# EasyEDA Pro project Project_FALLOUT HK PAD.epro

# Schematic Schematic2
Board Name: PCB3; Create Date: 2026-05-14; Page Name: P1; Project Name: FALLOUT HK PAD; Schematic Name: Schematic2; Update Date: 2026-05-15; Company: EasyEDA.com; Page Size: A4; Version: V1.0
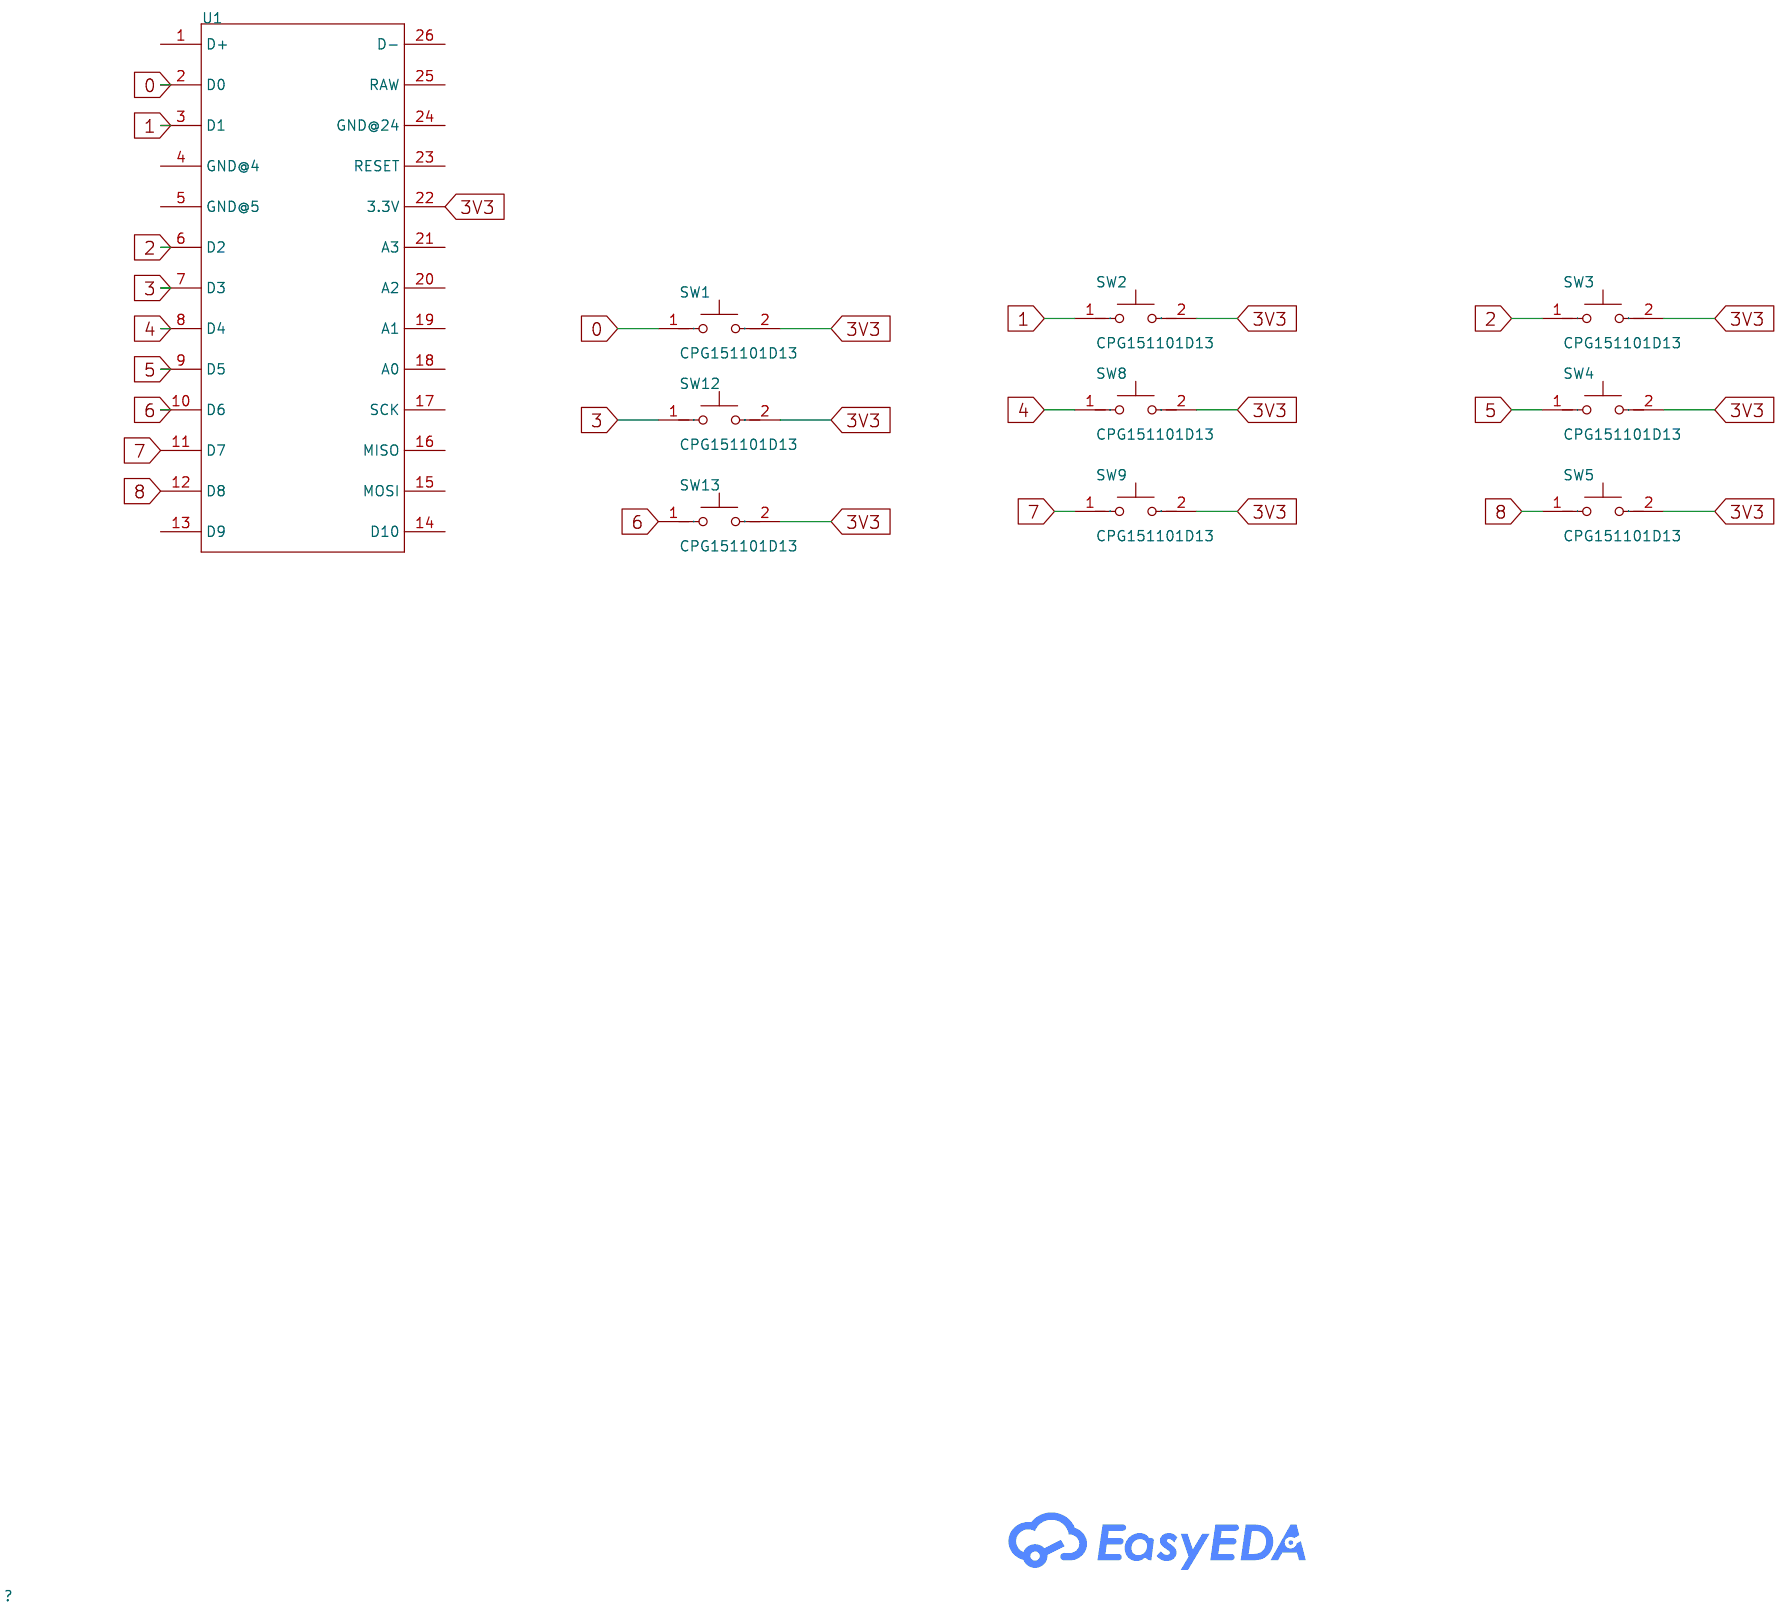
[diagram p0: schematic sheet]

## Parts
SW1  CPG151101D13  [KEY-TH_CPG1511F01S0X]
SW2  CPG151101D13  [KEY-TH_CPG1511F01S0X]
SW3  CPG151101D13  [KEY-TH_CPG1511F01S0X]
SW4  CPG151101D13  [KEY-TH_CPG1511F01S0X]
SW5  CPG151101D13  [KEY-TH_CPG1511F01S0X]
SW8  CPG151101D13  [KEY-TH_CPG1511F01S0X]
SW9  CPG151101D13  [KEY-TH_CPG1511F01S0X]
SW12  CPG151101D13  [KEY-TH_CPG1511F01S0X]
SW13  CPG151101D13  [KEY-TH_CPG1511F01S0X]
U1  -  [KB2040_SMD]

## Library data of the parts
SW1-SW5 SW8 SW9 SW12 SW13 = CPG151101D13: Axis Type:Blue Switch Operation Force:50gf Conduction Travel:2.2mm Voltage Rating:12V Operating Temperature:-40℃~+70℃ Operating Temperature:-40℃~+70℃; LCSC Part Name: 青轴; Supplier Part: C49234235; Manufacturer: HanElectricity(瀚源); Supplier Footprint: 插件; JLCPCB Part Class: Extended Part; Datasheet: https://item.szlcsc.com/datasheet/CPG151101D13/51650377.html; Supplier: LCSC; Axis Type: Blue Switch; Operation Force: 50gf; Conduction Travel: 2.2mm; Voltage Rating: 12V; Operating Temperature: -40℃~+70℃
U1 = KB2040

## Nets
3V3: SW1.2 SW2.2 SW3.2 SW4.2 SW5.2 SW8.2 SW9.2 SW12.2 SW13.2 U1.22(3.3V)
0: SW1.1 U1.2(D0)
1: SW2.1 U1.3(D1)
2: SW3.1 U1.6(D2)
3: SW12.1 U1.7(D3)
4: SW8.1 U1.8(D4)
5: SW4.1 U1.9(D5)
6: SW13.1 U1.10(D6)
7: SW9.1 U1.11(D7)
8: SW5.1 U1.12(D8)

Not connected (* = marked no-connect by the designer): U1 1(D+) 4(GND@4) 5(GND@5) 13(D9) 14(D10) 15(MOSI) 16(MISO) 17(SCK) 18(A0) 19(A1) 20(A2) 21(A3) 23(RESET) 24(GND@24) 25(RAW) 26(D-)

# Board PCB3
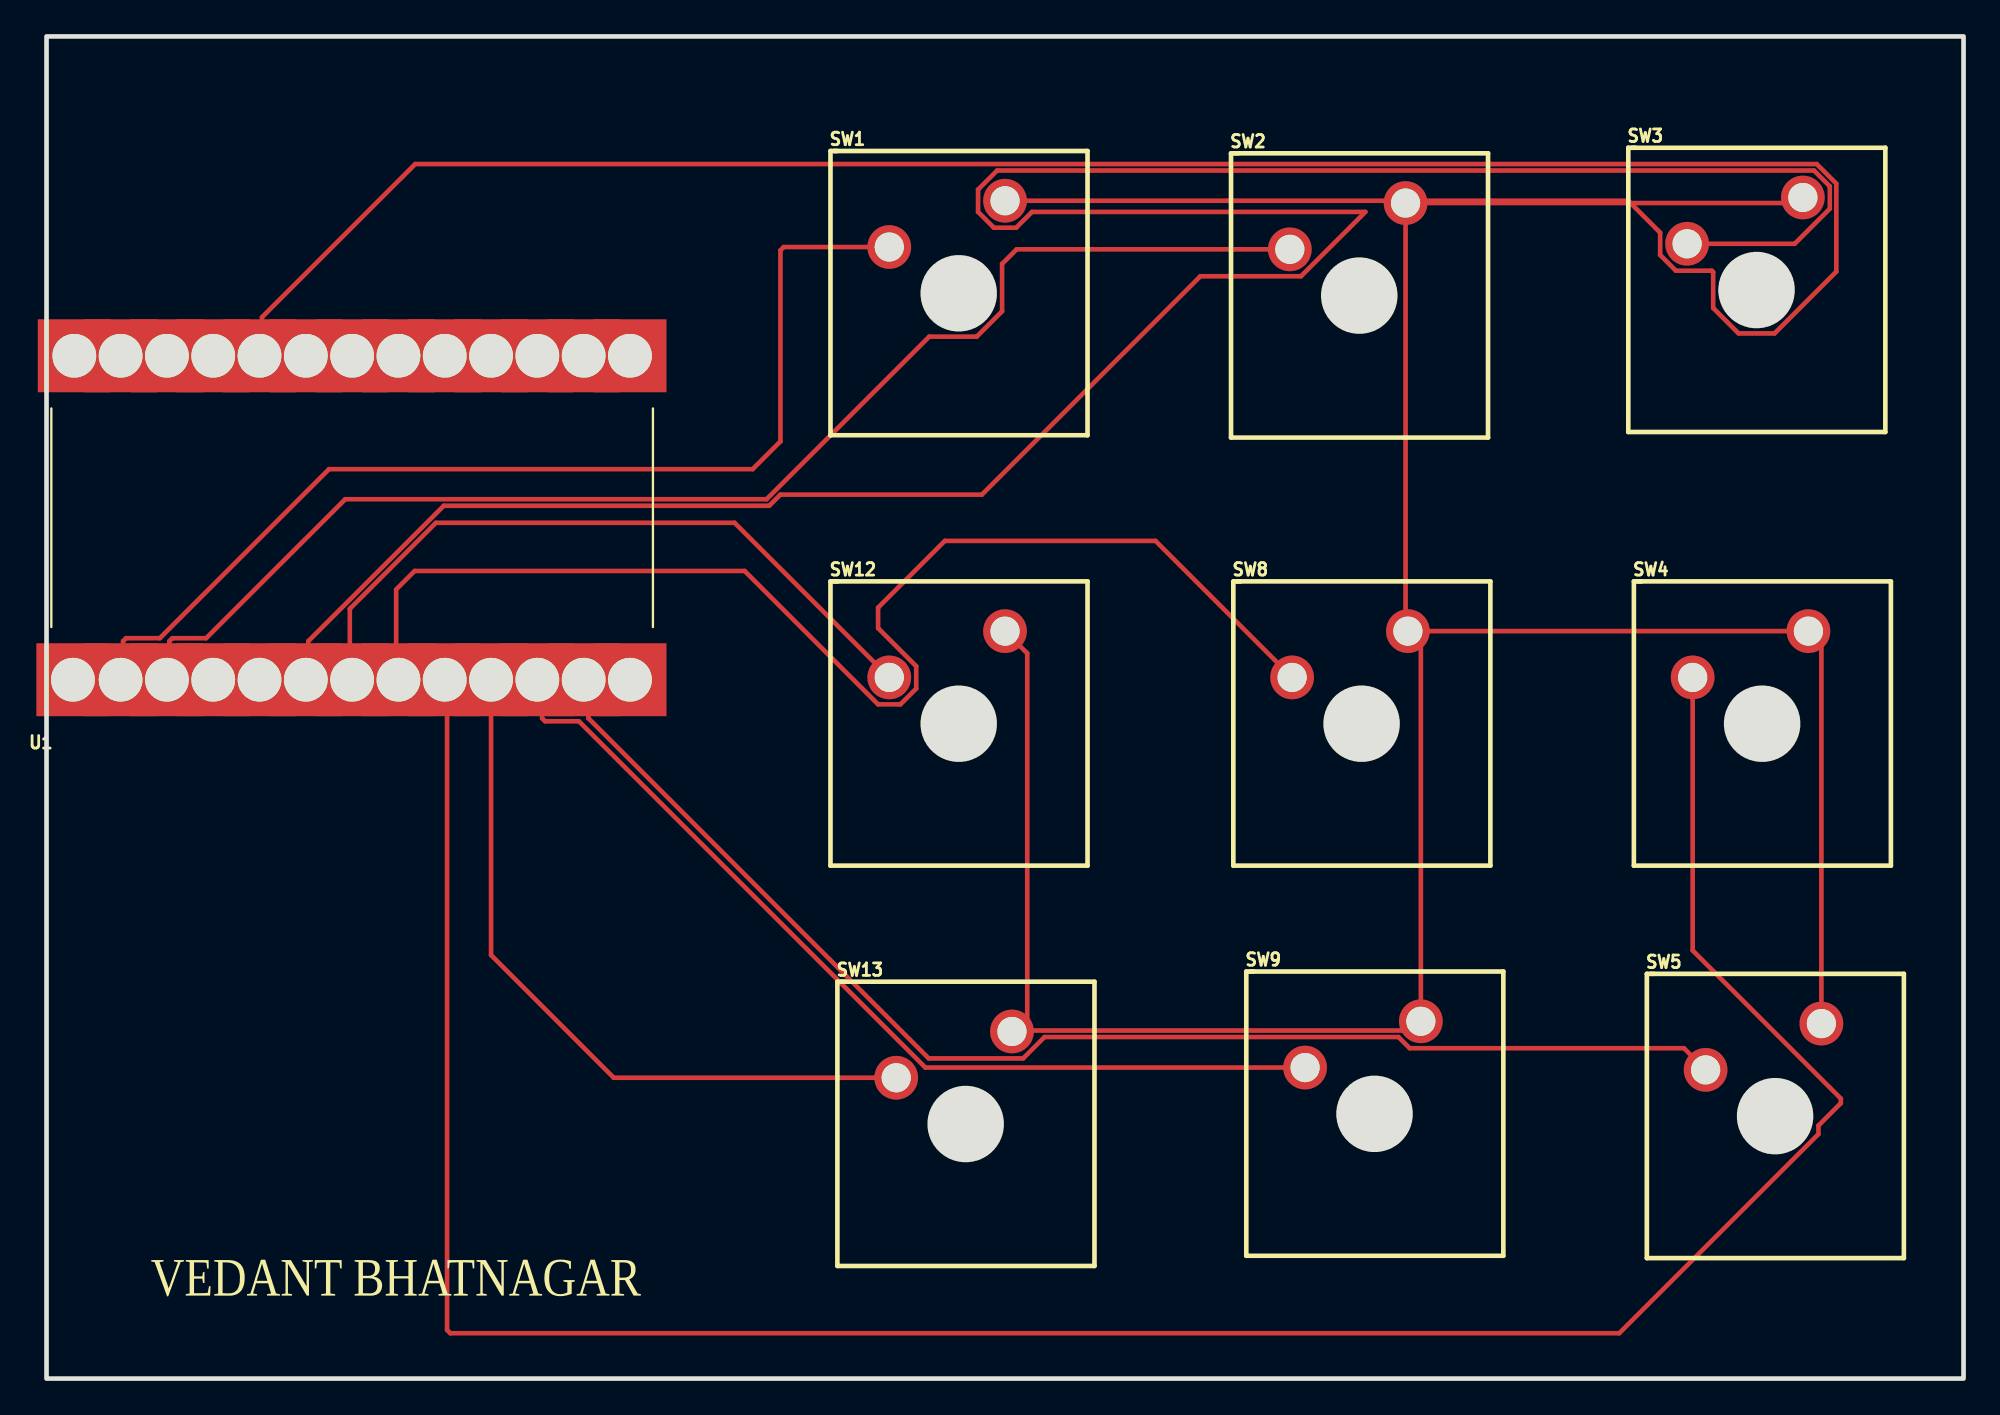
[diagram p1: board, top side]
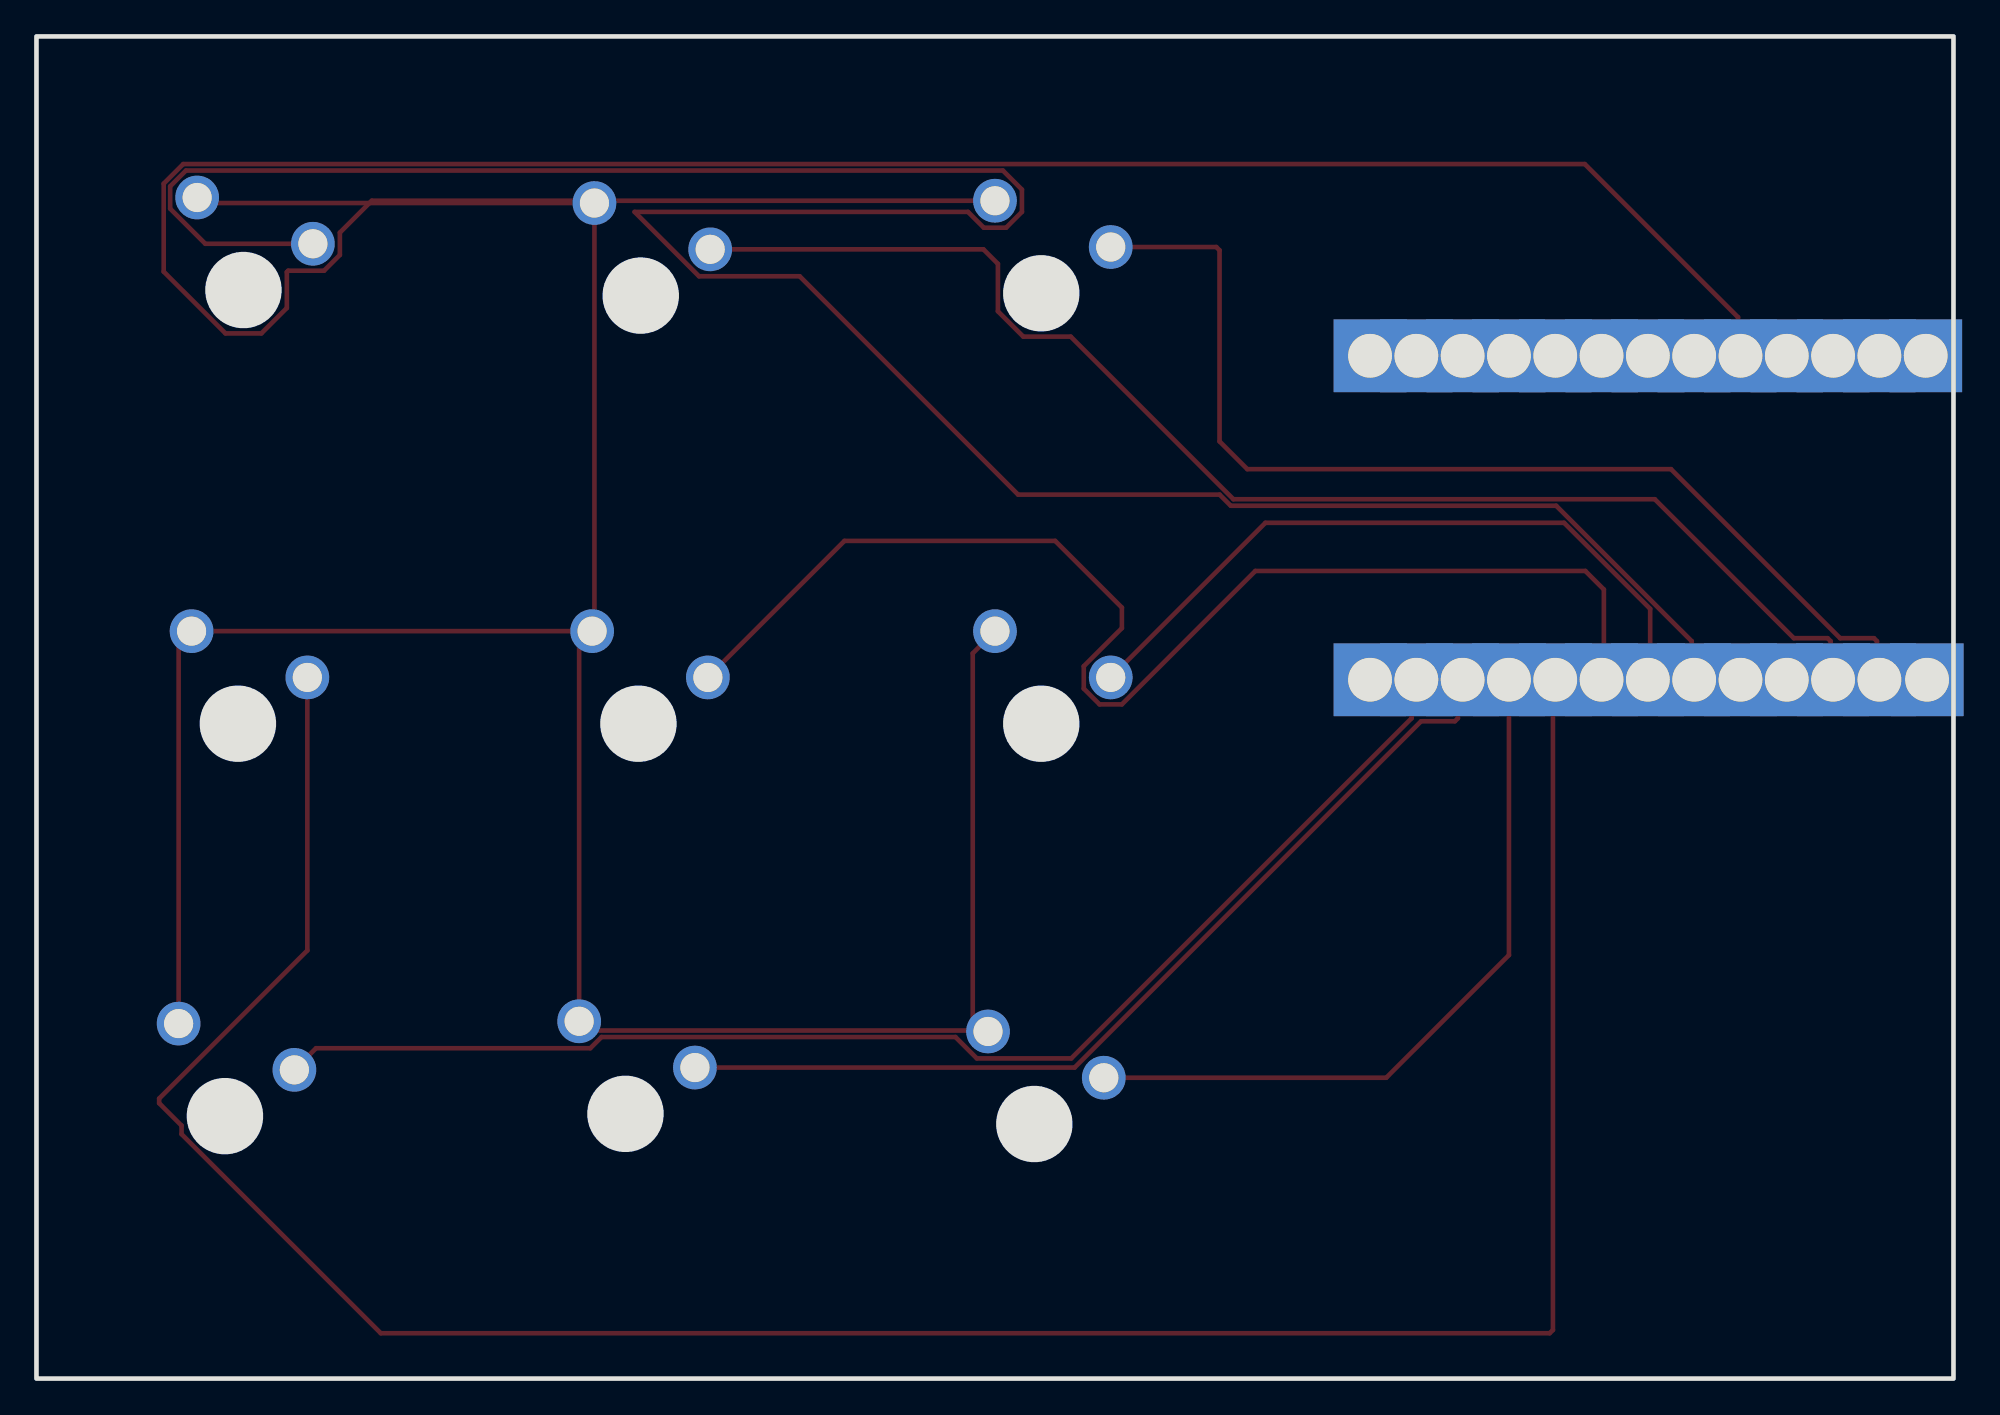
[diagram p2: board, bottom side, seen from below]

Outline 105.16 x 73.66 mm; copper layers: Top Layer, Bottom Layer. Coordinates in mm from the lower left corner of the outline.
Outline path: rectangle 0,73.66 105.16,0
Stack: Top Layer 0.035mm / Dielectric1 1.51mm FR4 er 4.5 / Bottom Layer 0.035mm

## Design rules (mm)
template: JLCPCB Capability(Two Layers Board)
spacing copperThickness1oz (default): track to track 0.102, other pairs 0.152 to 0.3
spacing copperThickness2oz: track to track 0.203, other pairs 0.152 to 0.3
track width copperThickness1oz (default): min 0.127, default 0.254, max 2.54
track width copperThickness2oz: min 0.203, default 0.254, max 2.54
differential pair differentialPair (default): width min 0.127, default 0.254, max 2.54; gap min 0.152, default 0.152
via viaSize (default): diameter min 0.5, default 0.61, max 10; hole min 0.3, default 0.305, max 6.3

## Placement (name value [footprint] x y rotation side)
SW1  CPG151101D13  [KEY-TH_CPG1511F01S0X]  49.4 63.37 0 top
SW2  CPG151101D13  [KEY-TH_CPG1511F01S0X]  71.37 63.25 0 top
SW3  CPG151101D13  [KEY-TH_CPG1511F01S0X]  93.17 63.55 0 top
SW4  CPG151101D13  [KEY-TH_CPG1511F01S0X]  93.47 39.75 0 top
SW5  CPG151101D13  [KEY-TH_CPG1511F01S0X]  94.18 18.21 0 top
SW8  CPG151101D13  [KEY-TH_CPG1511F01S0X]  71.5 39.75 0 top
SW9  CPG151101D13  [KEY-TH_CPG1511F01S0X]  72.21 18.34 0 top
SW12  CPG151101D13  [KEY-TH_CPG1511F01S0X]  49.4 39.75 0 top
SW13  CPG151101D13  [KEY-TH_CPG1511F01S0X]  49.78 17.78 0 top
U1  -  [KB2040_SMD]  16.76 47.24 0 top

## Footprints (pads in the part's own frame, mm; a bottom-side part is the same pattern mirrored in y, then rotated)
KB2040_SMD
  rect 4x4 hole 2.4: 1(-15.316,-8.89) 2(-12.7,-8.89) 3(-10.16,-8.89) 4(-7.62,-8.89) 5(-5.08,-8.89) 6(-2.54,-8.89) 7(0,-8.89) 8(2.54,-8.89) 9(5.08,-8.89) 10(7.62,-8.89) 11(10.16,-8.89) 12(12.7,-8.89) 13(15.24,-8.89) 14(15.24,8.89) 15(12.7,8.89) 16(10.16,8.89) 17(7.62,8.89) 18(5.08,8.89) 19(2.54,8.89) 20(0,8.89) 21(-2.54,8.89) 22(-5.08,8.89) 23(-7.62,8.89) 24(-10.16,8.89) 25(-12.7,8.89) 26(-15.24,8.89)
KEY-TH_CPG1511F01S0X
  round 2.4 hole 1.6: 1(-3.175,-1.27) 2(3.175,1.27)

## Nets
As in the schematic.

Pads without a net: U1 1 4 5 13 14 15 16 17 18 19 20 21 23 24 25 26

## Routing (per net, layer and track width the routed paths; a pad name or vN(x,y) marks a point on that pad's centre or on a via; arc(x,y) is an arc through that point)
3V3: length 304.6
  Top Layer w0.254: SW8.2 74.55,41.15 SW2.2 ; SW8.2 75.39,40.31 SW9.2 74.88,19.1 53.8,19.1 53.8,39.8 SW12.2 ; SW8.2 SW4.2 97.36,40.31 SW5.2 ; 86.89,64.52 96.04,64.52 96.34,64.82 ; 86.89,64.52 SW2.2 ; 86.89,64.52 88.51,62.89 88.51,61.67 89.38,60.8 91.35,60.8 91.42,60.73 91.42,58.76 92.82,57.36 94.79,57.36 98.18,60.75 98.18,65.58 97.1,66.66 20.22,66.66 11.82,58.25 11.82,56.4 11.56,56.13 ; 86.89,64.52 86.76,64.64 74.42,64.64 ; SW2.2 74.42,64.64 ; 74.42,64.64 52.58,64.64
0: length 59.4
  Top Layer w0.254: SW1.1 40.44,62.1 40.26,61.92 40.26,51.44 38.73,49.91 15.49,49.91 6.22,40.63 4.36,40.63 4.2,40.47 4.2,38.62 3.94,38.35
1: length 74.1
  Top Layer w0.254: 6.48,38.35 6.74,38.62 6.74,40.47 6.9,40.63 8.76,40.63 16.38,48.26 39.5,48.26 48.42,57.18 51.02,57.18 52.42,58.58 52.42,61.18 53.21,61.98 SW2.1
2: length 150.5
  Top Layer w0.254: SW3.1 95.89,62.28 97.82,64.21 97.82,65.43 96.95,66.3 52.14,66.3 51.1,65.26 51.1,64.03 51.97,63.16 53.19,63.16 54.06,64.03 72.34,64.03 68.81,60.5 63.29,60.5 51.31,48.51 40.25,48.51 39.64,47.9 21.79,47.9 14.36,40.47 14.36,38.62 14.1,38.35
3: length 39
  Top Layer w0.254: SW12.1 37.74,46.97 21.36,46.97 16.64,42.25 16.64,38.35
4: length 69.9
  Top Layer w0.254: 19.18,38.35 19.18,43.31 20.19,44.32 38.29,44.32 45.62,37 46.84,37 47.71,37.87 47.71,39.09 45.62,41.19 45.62,42.31 49.28,45.97 60.83,45.97 SW8.1
5: length 144.6
  Top Layer w0.254: 21.72,38.35 21.79,38.35 21.97,38.17 21.97,2.67 22.15,2.49 86.27,2.49 97.2,13.42 97.2,13.89 98.42,15.11 98.42,15.37 90.3,23.5 SW4.1
6: length 40.1
  Top Layer w0.254: U1.10 24.38,23.24 31.11,16.51 SW13.1
7: length 52
  Top Layer w0.254: 69.04,17.07 48.21,17.07 29.2,36.08 27.35,36.08 27.18,36.24 27.18,38.09 U1.11
8: length 72.5
  Top Layer w0.254: U1.12 29.72,38.09 29.72,36.24 48.39,17.57 53.57,17.57 54.75,18.75 74.16,18.75 74.77,18.13 89.82,18.13 SW5.1

## Text on the board
Top Silkscreen Layer: VEDANT BHATNAGAR
